# Altium schematic sheet devices.SchDoc
size A3
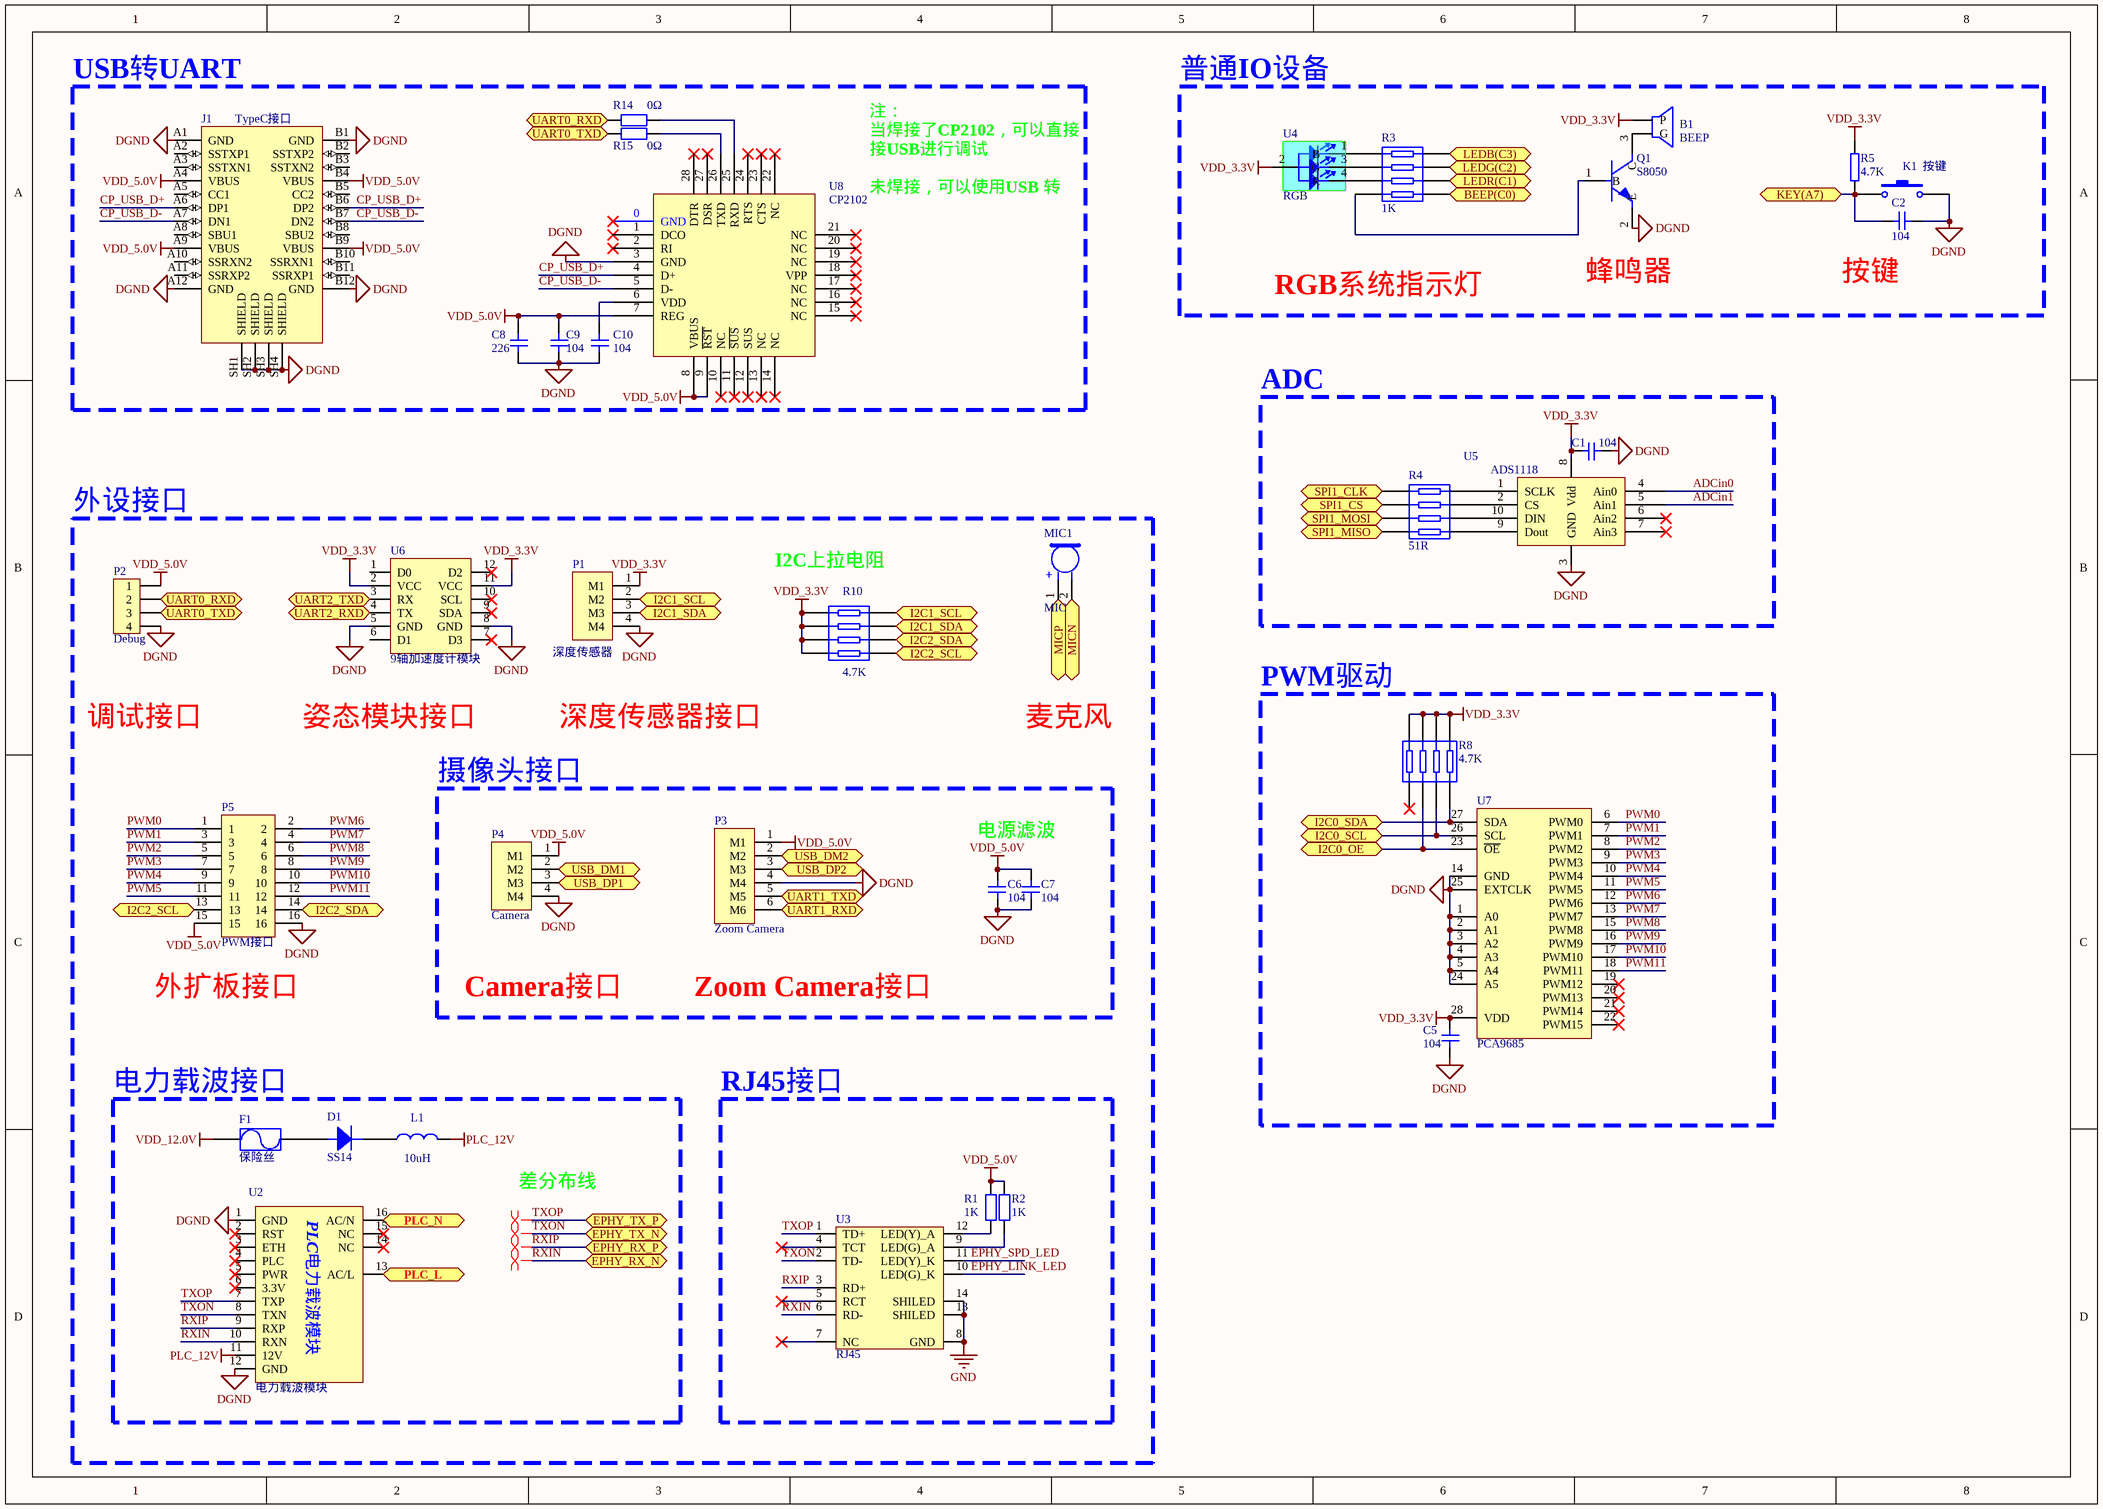
[diagram p0: devices.SchDoc]

## Parts
B1  BEEP  [BUZZER]
C1  104  [0805C]
C2  104  [0805C]
C5  104  [0805C]
C6  104  [0805C]
C7  104  [0805C]
C8  226  [0805C]
C9  104  [0805C]
C10  104  [0805C]
D1  SS14  [SMA/DO-214AC]
F1  保险丝  [FUSE-1206]
J1  TypeC接口  [Type_C-UJ31-CH-G2-SMT-TR(Primary)]
K1  按键  [贴片按键]
L1  10uH  [1206L]
MIC1  MIC  [MIC]
P1  深度传感器  [MX1.25S-4P]
P2  Debug  [Header 4(排母)]
P3  Zoom Camera  [PH2.0WS-6P]
P4  Camera  [接线端子(2.54mm)-4PIN]
P5  PWM接口  [HDR2X8/2.54-SMD]
Q1  S8050  [SOT-23]
R1  1K  [0805R]
R2  1K  [0805R]
R3  1K  [排阻(4位贴片)]
R4  51R  [排阻(4位贴片)]
R5  4.7K  [0805R]
R8  4.7K  [排阻(4位贴片)]
R10  4.7K  [排阻(4位贴片)]
R14  0Ω  [0805R]
R15  0Ω  [0805R]
U2  电力载波模块  [电力载波模块6410]
U3  RJ45  [RJ45]
U4  RGB  [RGB-3528]
U5  ADS1118  [VSSOP-10]
U6  9轴加速度计模块  [9轴加速度计]
U7  PCA9685  [TSSOP-28]
U8  CP2102  [QFN-28]

## Blocks framed on the sheet
USB转UART: C8-C10 J1 R14 R15 U8
ADC: C1 R4 U5
PWM驱动: C5 R8 U7
电力载波接口: D1 F1 L1 U2
RJ45接口: R1 R2 U3

## Ports
BEEP(C0), EPHY_RX_N, EPHY_RX_P, EPHY_TX_N, EPHY_TX_P, I2C0_OE, I2C0_SCL, I2C0_SDA, I2C1_SCL, I2C1_SDA, I2C2_SCL, I2C2_SDA, KEY(A7), LEDB(C3), LEDG(C2), LEDR(C1), MICN, MICP, PLC_L, PLC_N, SPI1_CLK, SPI1_CS, SPI1_MISO, SPI1_MOSI, UART0_RXD, UART0_TXD, UART1_RXD, UART1_TXD, UART2_RXD, UART2_TXD, USB_DM1, USB_DM2, USB_DP1, USB_DP2

## Nets
DGND: C1.2 C2.1 C5.1 C6.2 C7.2 C8.1 C9.1 C10.1 J1.A1(GND) J1.A12(GND) J1.B1(GND) J1.B12(GND) J1.SH1(SHIELD) J1.SH2(SHIELD) J1.SH3(SHIELD) J1.SH4(SHIELD) K1.2 P1.4(M4) P2.4 P3.4(M4) P4.4(M4) P5.16 Q1.2(E) U2.1(GND) U2.12(GND) U5.3(GND) U6.5(GND) U6.8(GND) U7.1(A0) U7.2(A1) U7.3(A2) U7.4(A3) U7.5(A4) U7.14(GND) U7.24(A5) U7.25(EXTCLK) U8.3(GND)
GND: U3.8(GND) U3.13(SHILED) U3.14(SHILED)
PLC_12V: L1.2 U2.11(12V)
VDD_3.3V: B1.1(P) C1.1 C5.2 P1.1(M1) R5.2 R8.1 R8.3 R8.5 R8.7 R10.2 R10.4 R10.6 R10.8 U4.2 U5.8(Vdd) U6.2(VCC) U6.11(VCC) U7.28(VDD)
VDD_5.0V: C6.1 C7.1 C8.2 C9.2 J1.A4(VBUS) J1.A9(VBUS) J1.B4(VBUS) J1.B9(VBUS) P2.1 P3.1(M1) P4.1(M1) P5.15 R1.1 R2.1 U8.7(REG) U8.8(VBUS) U8.9(~{RST})
VDD_12.0V: F1.1
ADCin0: U5.4(Ain0)
ADCin1: U5.5(Ain1)
BEEP(C0): R3.8 ; port BEEP(C0)
CP_USB_D+: J1.A6(DP1) J1.B6(DP2) U8.4(D+)
CP_USB_D-: J1.A7(DN1) J1.B7(DN2) U8.5(D-)
EPHY_LINK_LED: U3.10(LED(G)_K)
EPHY_SPD_LED: U3.11(LED(Y)_K)
I2C0_OE: R8.4 U7.23(~{OE}) ; port I2C0_OE
I2C0_SCL: R8.6 U7.26(SCL) ; port I2C0_SCL
I2C0_SDA: R8.8 U7.27(SDA) ; port I2C0_SDA
I2C1_SCL: P1.2(M2) R10.7 ; port I2C1_SCL
I2C1_SDA: P1.3(M3) R10.5 ; port I2C1_SDA
I2C2_SCL: P5.13 R10.1 ; port I2C2_SCL
I2C2_SDA: P5.14 R10.3 ; port I2C2_SDA
KEY(A7): C2.2 K1.1 R5.1 ; port KEY(A7)
LEDB(C3): R3.2 ; port LEDB(C3)
LEDG(C2): R3.4 ; port LEDG(C2)
LEDR(C1): R3.6 ; port LEDR(C1)
MICN: MIC1.2(N) ; port MICN
MICP: MIC1.1(P) ; port MICP
PLC_L: U2.13(AC/L) ; port PLC_L
PLC_N: U2.16(AC/N) ; port PLC_N
PWM0: P5.1 U7.6(PWM0)
PWM1: P5.3 U7.7(PWM1)
PWM2: P5.5 U7.8(PWM2)
PWM3: P5.7 U7.9(PWM3)
PWM4: P5.9 U7.10(PWM4)
PWM5: P5.11 U7.11(PWM5)
PWM6: P5.2 U7.12(PWM6)
PWM7: P5.4 U7.13(PWM7)
PWM8: P5.6 U7.15(PWM8)
PWM9: P5.8 U7.16(PWM9)
PWM10: P5.10 U7.17(PWM10)
PWM11: P5.12 U7.18(PWM11)
RXIN: U2.10(RXN) U3.6(RD-) ; port EPHY_RX_N
RXIP: U2.9(RXP) U3.3(RD+) ; port EPHY_RX_P
SPI1_CLK: R4.2 ; port SPI1_CLK
SPI1_CS: R4.4 ; port SPI1_CS
SPI1_MISO: R4.8 ; port SPI1_MISO
SPI1_MOSI: R4.6 ; port SPI1_MOSI
TXON: U2.8(TXN) U3.2(TD-) ; port EPHY_TX_N
TXOP: U2.7(TXP) U3.1(TD+) ; port EPHY_TX_P
UART0_RXD: P2.2 R14.2 ; port UART0_RXD
UART0_TXD: P2.3 R15.2 ; port UART0_TXD
UART1_RXD: P3.6(M6) ; port UART1_RXD
UART1_TXD: P3.5(M5) ; port UART1_TXD
UART2_RXD: U6.4(TX) ; port UART2_RXD
UART2_TXD: U6.3(RX) ; port UART2_TXD
USB_DM1: P4.2(M2) ; port USB_DM1
USB_DM2: P3.2(M2) ; port USB_DM2
USB_DP1: P4.3(M3) ; port USB_DP1
USB_DP2: P3.3(M3) ; port USB_DP2
NetB1_2: B1.2(G) Q1.3(C)
NetC10_2: C10.2 U8.6(VDD)
NetD1_1: D1.1 F1.2
NetD1_2: D1.2 L1.1
NetQ1_1: Q1.1(B) R3.7
NetR1_2: R1.2 U3.12(LED(Y)_A)
NetR2_2: R2.2 U3.9(LED(G)_A)
NetR3_1: R3.1 U4.1(B)
NetR3_3: R3.3 U4.3(G)
NetR3_5: R3.5 U4.4(R)
NetR4_1: R4.1 U5.1(SCLK)
NetR4_3: R4.3 U5.2(CS)
NetR4_5: R4.5 U5.10(DIN)
NetR4_7: R4.7 U5.9(Dout)
NetR14_1: R14.1 U8.25(RXD)
NetR15_1: R15.1 U8.26(TXD)

Not connected (* = marked no-connect by the designer): J1 A2(SSTXP1) A3(SSTXN1) A5(CC1) A8(SBU1) A10(SSRXN2) A11(SSRXP2) B2(SSTXP2) B3(SSTXN2) B5(CC2) B8(SBU2) B10(SSRXN1) B11(SSRXP1); R8 2*; U2 2(RST)* 3(ETH)* 4(PLC)* 5(PWR)* 6(3.3V)* 14(NC)* 15(NC)*; U3 4(TCT)* 5(RCT)* 7(NC)*; U5 6(Ain2)* 7(Ain3)*; U6 1(D0) 6(D1) 7(D3)* 9(SDA)* 10(SCL)* 12(D2)*; U7 19(PWM12)* 20(PWM13)* 21(PWM14)* 22(PWM15)*; U8 0(GND)* 1(DCO)* 2(RI)* 10(NC)* 11(~{SUS})* 12(SUS)* 13(NC)* 14(NC)* 15(NC)* 16(NC)* 17(NC)* 18(VPP)* 19(NC)* 20(NC)* 21(NC)* 22(NC)* 23(CTS)* 24(RTS)* 27(DSR)* 28(DTR)*

## Layout directives
differential pair: RXIN, RXIP, TXON, TXOP

## Notes on the sheet
- 普通IO设备
- 注：
  当焊接了CP2102，可以直接接USB进行调试
  未焊接，可以使用USB 转TTL接 Debug排针
- RGB系统指示灯
- (near Q1) 蜂鸣器
- 按键
- 外设接口
- (near R10) I2C上拉电阻
- 调试接口
- 姿态模块接口
- 摄像头接口
- 深度传感器接口
- 麦克风
- 电源滤波
- (near P5) 外扩板接口
- Camera接口
- Zoom Camera接口
- 差分布线
- (in symbol MIC) +
- (in symbol 电力载波模块6410) PLC电力载波模块

## Library data of the parts
C1 C2 C5-C10 = Cap1: 无极贴片电容
D1 = Diode: 二极管
F1 = Fuse
J1 = Type_C-24P-UJ31-CH-G2-SMT-TR: UJ31 Series Single Port 24 Contact Horizontal SMT Shielded USB-C 3.1 Receptacle
K1 = 贴片按键: 轻触开关
L1 = L: 电感
P1 P4 = 接线端子-4PIN: 4PIN
P2 = Header 4: 排针
P3 = 接线端子-6PIN: 6PIN
P5 = Header 2X8
Q1 = NPN: NPN三极管
R1 R2 R5 R14 R15 = Res: 电阻
R3 R4 R8 R10 = Res-4: 排阻
U2 = 电力载波模块6410
U6 = 9轴加速度计
U8 = CP2102: USB转串口芯片